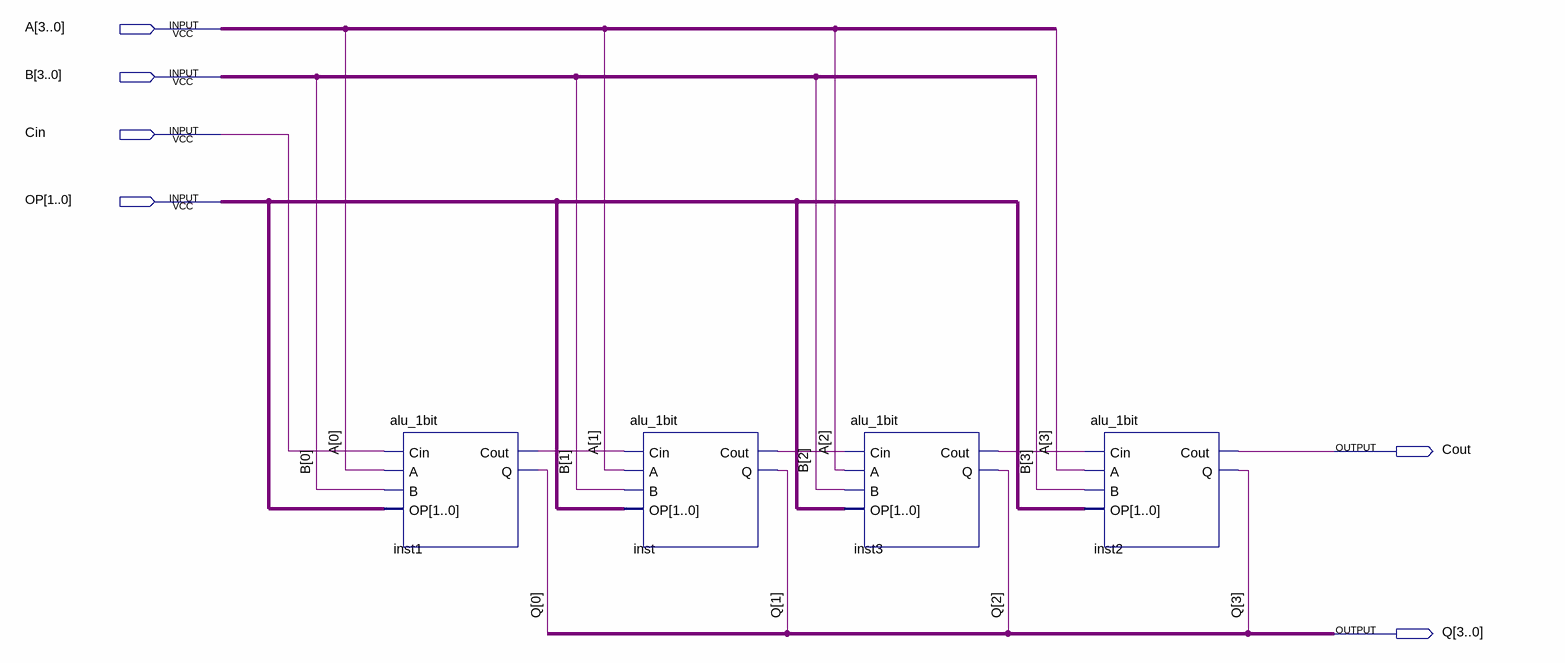
[diagram p0: schematic sheet]
// Quartus schematic alu_4bit.bdf as structural Verilog: 4 symbols, 6 pins
module alu_4bit (
  input  [3:0] A,
  input  [3:0] B,
  input  Cin,
  input  [1:0] OP,
  output Cout,
  output [3:0] Q
);

  wire inst1_cout, inst3_cout, inst_cout;

  alu_1bit inst1 (.Cin(Cin), .A(A[0]), .B(B[0]), .OP(OP), .Cout(inst1_cout), .Q(Q[0]));
  alu_1bit inst (.Cin(inst1_cout), .A(A[1]), .B(B[1]), .OP(OP), .Cout(inst_cout), .Q(Q[1]));
  alu_1bit inst3 (.Cin(inst_cout), .A(A[2]), .B(B[2]), .OP(OP), .Cout(inst3_cout), .Q(Q[2]));
  alu_1bit inst2 (.Cin(inst3_cout), .A(A[3]), .B(B[3]), .OP(OP), .Cout(Cout), .Q(Q[3]));
endmodule
